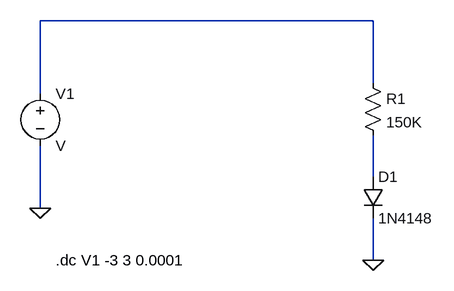
[diagram p0: schematic ECDLab1Part1.asc]
ECDLab1Part1.asc, the LTspice schematic file:
Version 4
SHEET 1 880 680
WIRE 480 0 -32 0
WIRE 480 96 480 0
WIRE -32 112 -32 0
WIRE 480 240 480 176
WIRE -32 288 -32 192
WIRE 480 368 480 304
FLAG -32 288 0
FLAG 480 368 0
SYMBOL voltage -32 96 R0
SYMATTR InstName V1
SYMBOL res 464 80 R0
SYMATTR InstName R1
SYMATTR Value 150K
SYMBOL diode 464 240 R0
SYMATTR InstName D1
SYMATTR Value 1N4148
TEXT -8 368 Left 2 !.dc V1 -3 3 0.0001

The netlist it stands for:
* ECDLab1Part1.asc
V1 N001 0 V
R1 N001 N002 150K
D1 N002 0 1N4148
.model D D
.lib standard.dio
.dc V1 -3 3 0.0001
.backanno
.end